# Altium schematic sheet Main board.SchDoc
size B; SheetNumber: 2; SheetTotal: 2
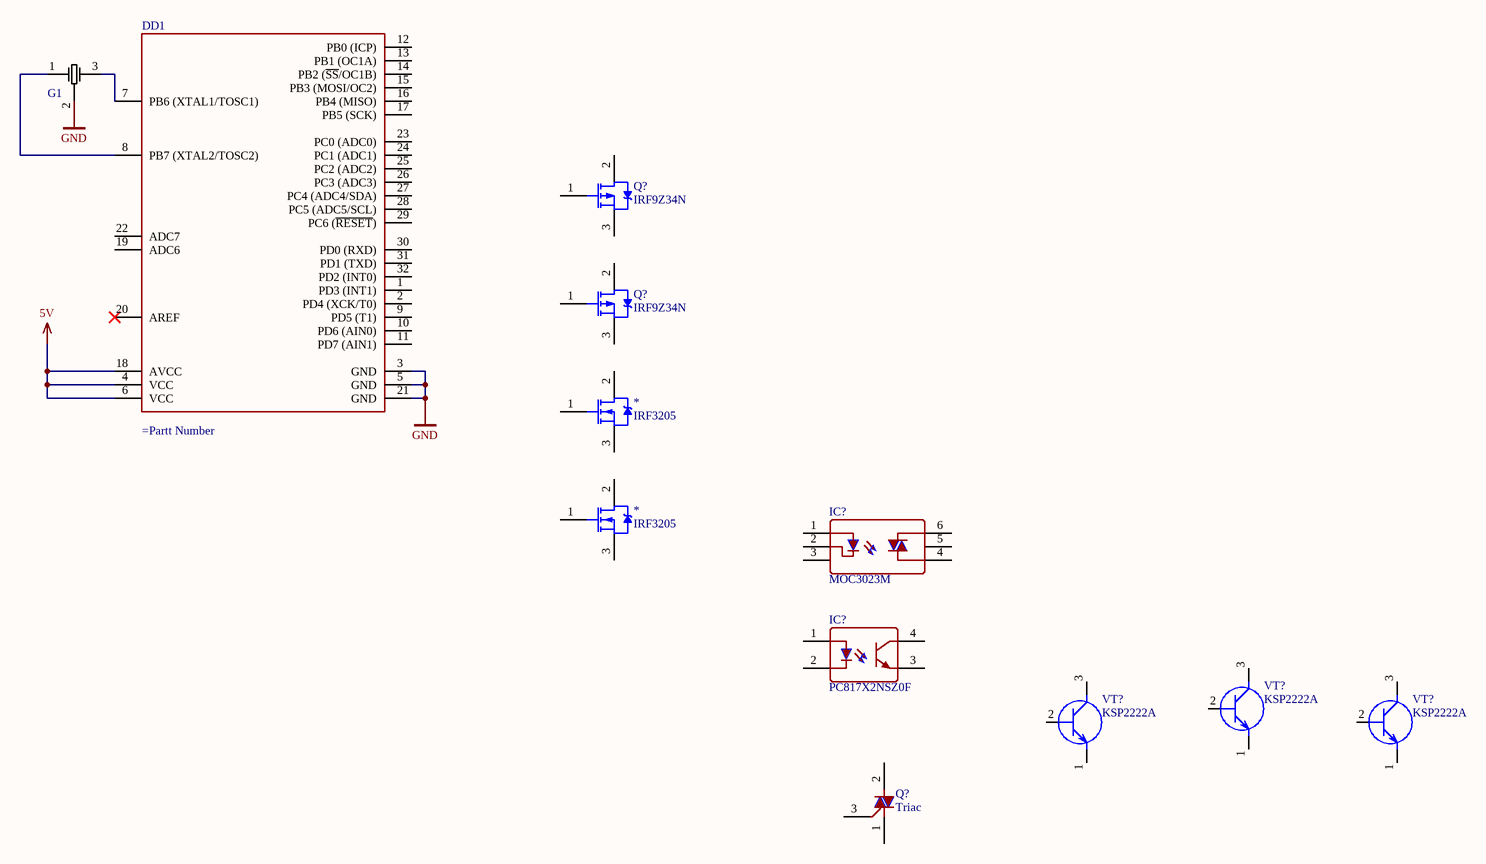
[diagram p0: Main board.SchDoc]

## Parts
(Parts that share a designator on the sheet are numbered #1, #2 ... from top to bottom, then left to right.)
*#1  IRF3205  [TO-220AB]
*#2  IRF3205  [TO-220AB]
DD1  (no value)  [TQFP32_N]
G1  8MHz 33pF  [CSTNE_G]  (value not drawn)
IC?#1  MOC3023M  [DIP762W51P254L851H508Q6N]
IC?#2  PC817X2NSZ0F  [DIP762W60P254L458H400Q4N]
Q?#1  IRF9Z34N  [TO-220AB]
Q?#2  IRF9Z34N  [TO-220AB]
Q?#3  Triac  [TO-220AB]
VT?#1  KSP2222A  [TO-92A]
VT?#2  KSP2222A  [TO-92A]
VT?#3  KSP2222A  [TO-92A]

## Nets
5V: DD1.4(VCC) DD1.6(VCC) DD1.18(AVCC)
GND: DD1.3(GND) DD1.5(GND) DD1.21(GND) G1.2
NetDD1_7: DD1.7(PB6_(XTAL1/TOSC1)) G1.3
NetDD1_8: DD1.8(PB7_(XTAL2/TOSC2)) G1.1

Not connected (* = marked no-connect by the designer): *#1 1(G) 2(D) 3(S); *#2 1(G) 2(D) 3(S); DD1 1(PD3_(INT1)) 2(PD4_(XCK/T0)) 9(PD5_(T1)) 10(PD6_(AIN0)) 11(PD7_(AIN1)) 12(PB0_(ICP)) 13(PB1_(OC1A)) 14(PB2_(~{SS}/OC1B)) 15(PB3_(MOSI/OC2)) 16(PB4_(MISO)) 17(PB5_(SCK)) 19(ADC6) 20(AREF)* 22(ADC7) 23(PC0_(ADC0)) 24(PC1_(ADC1)) 25(PC2_(ADC2)) 26(PC3_(ADC3)) 27(PC4_(ADC4/SDA)) 28(PC5_(ADC5/SCL)) 29(PC6_(~{RESET})) 30(PD0_(RXD)) 31(PD1_(TXD)) 32(PD2_(INT0)); IC?#1 1 2 3 4 5 6; IC?#2 1 2 3 4; Q?#1 1(G) 2(D) 3(S); Q?#2 1(G) 2(D) 3(S); Q?#3 1 2 3; VT?#1 1(E) 2(B) 3(C); VT?#2 1(E) 2(B) 3(C); VT?#3 1(E) 2(B) 3(C)

## Library data of the parts
DD1 = ATMEGA328: IC MCU 8BIT 32KB FLASH 32TQFP; Manufacturer Part Number: ATMEGA328PB-AU; Part Number: ATMEGA328; HelpURL: https://www.digikey.com/product-detail/en/microchip-technology/ATMEGA328PB-AU/ATMEGA328PB-AU-ND/5638812; Digi-Key Part Number: ATMEGA328PB-AU-ND
G1 = CSTNE8M00G550000R0: Resonators 8.0000MHz 33pF SMD CHP Resntr; Part Number: CSTNE8M00G550000R0; HelpURL: https://www.mouser.com/ProductDetail/Murata-Electronics/CSTNE8M00G550000R0?qs=sGAEpiMZZMsBj6bBr9Q9aZiWbAMN9VKZL2sPd%252BqabYTr9Kzmh3hi1Q%3D%3D; Price$: 0.148; Digi-Key Part Number: 490-17958-1-ND; Manufacturer Part Number: CSTNE8M00G550000R0; Package: SMD-3pin; Mouser Part Number: 81-CSTNE8M00G550000R
IC?#1 = MOC3023M: Integrated Circuit; Manufacturer_Name: onsemi; Datasheet Link: https://www.onsemi.com/pub/Collateral/MOC3023M-D.PDF; Height: 5.08mm; Manufacturer_Part_Number: MOC3023M; Mouser Part Number: 512-MOC3023M; Mouser Price/Stock: https://www.mouser.co.uk/ProductDetail/ON-Semiconductor-Fairchild/MOC3023M?qs=yRUxxYa83cjcpuqK%2Fq2htA%3D%3D; Arrow Part Number: MOC3023M; Arrow Price/Stock: https://www.arrow.com/en/products/moc3023m/on-semiconductor?region=europe
IC?#2 = PC817X2NSZ0F: Integrated Circuit; Manufacturer_Name: Sharp Microelectronics; Datasheet Link: https://datasheet.datasheetarchive.com/originals/distributors/Datasheets_SAMA/458e45842a103a05998fcebbd6f7366e.pdf; Height: 4mm; Manufacturer_Part_Number: PC817X2NSZ0F; Mouser Part Number: N/A; Mouser Price/Stock: https://www.mouser.co.uk/ProductDetail/Sharp-Microelectronics/PC817X2NSZ0F?qs=6kT3pPPHxnU7uYWM8Yy85A%3D%3D
Q?#1 Q?#2 = IRF9Z34N: Note: Pin 2 is electrically connected to pin 4.; Published: 8-Jun-2000; LatestRevisionDate: 17-Jul-2002; LatestRevisionNote: Re-released for DXP Platform.; DatasheetVersion: Aug-1997; PackageVersion: Feb-1997; PackageReference: TO-220AB; Publisher: Altium Limited; PackageDescription: TO, Thru-Hole, Vertical, Heatsink Mounted; 3 In-Line Leads; Pitch 2.54 mm; ComponentLink1Description: Manufacturer Link; ComponentLink1URL: http://www.irf.com/; ComponentLink2Description: Datasheet; ComponentLink2URL: http://www.irf.com/product-info/datasheets/data/irf9z34n.pdf; Part Number: IRF9Z34N; HelpURL: http://datasheet.octopart.com/IRF9Z34N-International-Rectifier-datasheet-7830620.pdf
Q?#3 = BTA08: Part Number: BTA08
*#1 *#2 = IRF3205: Part Number: IRF3205
VT?#1-VT?#3 = KSP2222A: Part Number: KSP2222A; HelpURL: https://lib.chipdip.ru/238/DOC000238553.pdf